# Altium schematic sheet supply.SchDoc
size A4; SheetNumber: 9; SheetTotal: 12; SPICEModelCacheMDRHNIGR: <root> / <DocumentId>MDRHNIGR</DocumentId> / </root>
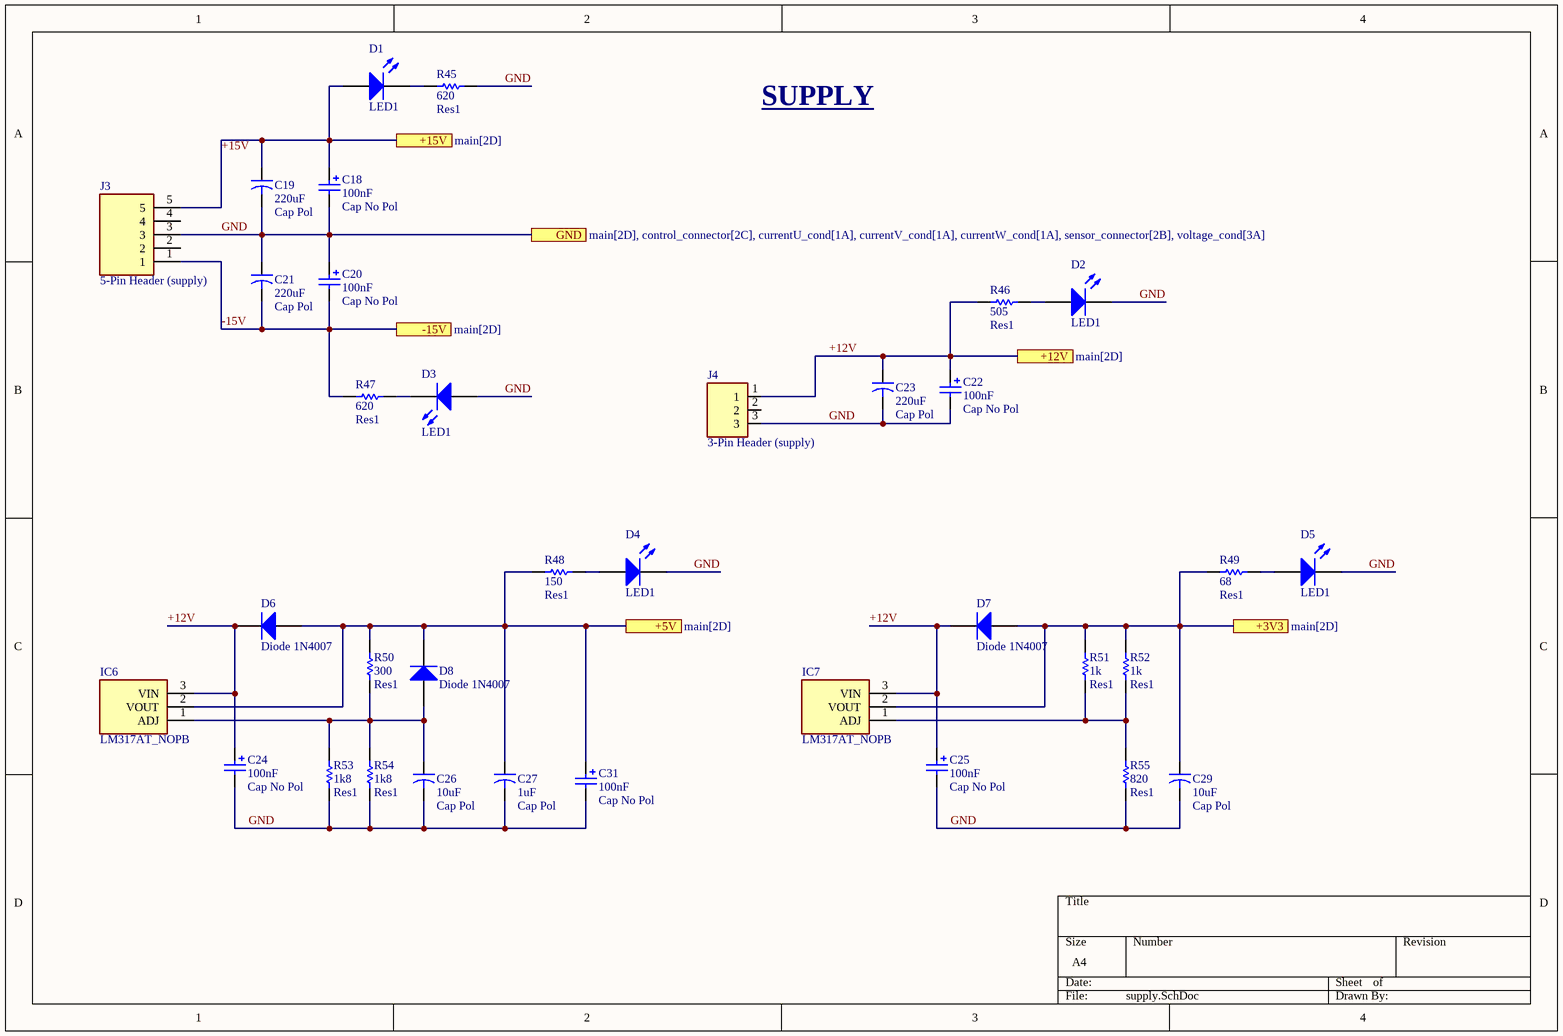
[diagram p0: supply.SchDoc]

## Parts
C18  Cap No Pol  value 100nF  [RAD-0.1_mod]
C19  Cap Pol  value 220uF  [CAPR5-4X5_mod]
C20  Cap No Pol  value 100nF  [RAD-0.1_mod]
C21  Cap Pol  value 220uF  [CAPR5-4X5_mod]
C22  Cap No Pol  value 100nF  [RAD-0.1_mod]
C23  Cap Pol  value 220uF  [CAPR5-4X5_mod]
C24  Cap No Pol  value 100nF  [RAD-0.1_mod]
C25  Cap No Pol  value 100nF  [RAD-0.1_mod]
C26  Cap Pol  value 10uF  [CAPR5-4X5_mod]
C27  Cap Pol  value 1uF  [CAPR5-4X5_mod]
C29  Cap Pol  value 10uF  [CAPR5-4X5_mod]
C31  Cap No Pol  value 100nF  [RAD-0.1_mod]
D1  LED1  [PIN2_mod]
D2  LED1  [PIN2_mod]
D3  LED1  [PIN2_mod]
D4  LED1  [PIN2_mod]
D5  LED1  [PIN2_mod]
D6  Diode 1N4007  [DO-41_mod]
D7  Diode 1N4007  [DO-41_mod]
D8  Diode 1N4007  [DO-41_mod]
IC6  LM317AT_NOPB  [TO254_mod]
IC7  LM317AT_NOPB  [TO254_mod]
J3  5-Pin Header (supply)  [MSTBA_5-PIN_HEADER_mod]
J4  3-Pin Header (supply)  [MSTBA_3-PIN_HEADER_mod]
R45  Res1  value 620  [AXIAL-0.3_mod]
R46  Res1  value 505  [AXIAL-0.3_mod]
R47  Res1  value 620  [AXIAL-0.3_mod]
R48  Res1  value 150  [AXIAL-0.3_mod]
R49  Res1  value 68  [AXIAL-0.3_mod]
R50  Res1  value 300  [AXIAL-0.3_mod]
R51  Res1  value 1k  [AXIAL-0.3_mod]
R52  Res1  value 1k  [AXIAL-0.3_mod]
R53  Res1  value 1k8  [AXIAL-0.3_mod]
R54  Res1  value 1k8  [AXIAL-0.3_mod]
R55  Res1  value 820  [AXIAL-0.3_mod]

## Ports
+3V3 (see main[2D]), +5V (see main[2D]), +12V (see main[2D]), +15V (see main[2D]), -15V (see main[2D]), GND (see main[2D], control_connector[2C], currentU_cond[1A], currentV_cond[1A], currentW_cond[1A], sensor_connector[2B], voltage_cond[3A])

## Nets
+3V3: C29.1 D7.1(A) IC7.2(VOUT) R49.1 R51.1 R52.1 ; port +3V3
+5V: C27.1 C31.1 D6.1(A) D8.2(K) IC6.2(VOUT) R48.1 R50.1 ; port +5V
+12V: C22.1 C23.1 C24.1 C25.1 D6.2(K) D7.2(K) IC6.3(VIN) IC7.3(VIN) J4.1 R46.1 ; port +12V
+15V: C18.1 C19.1 D1.1(A) J3.5 ; port +15V
-15V: C20.2 C21.2 J3.1 R47.2 ; port -15V
GND: C18.2 C19.2 C20.1 C21.1 C22.2 C23.2 C24.2 C25.2 C26.2 C27.2 C29.2 C31.2 D2.2(K) D3.1(A) D4.2(K) D5.2(K) J3.3 J4.3 R45.2 R53.2 R54.2 R55.2 ; port GND
NetC26_1: C26.1 D8.1(A) IC6.1(ADJ) R50.2 R53.1 R54.1
NetD1_2: D1.2(K) R45.1
NetD2_1: D2.1(A) R46.2
NetD3_2: D3.2(K) R47.1
NetD4_1: D4.1(A) R48.2
NetD5_1: D5.1(A) R49.2
NetIC7_1: IC7.1(ADJ) R51.2 R52.2 R55.1

Not connected (* = marked no-connect by the designer): J3 2 4; J4 2

## Notes on the sheet
- SUPPLY

## Library data of the parts
C18 C20 C22 C24 C25 C31 = Cap No Pol: Polarized Capacitor (Radial); Published: 8-Jun-2000; LatestRevisionDate: 17-Jul-2002; LatestRevisionNote: Re-released for DXP Platform.; PackageReference: RB7.6-15; Publisher: Altium Limited; PackageDescription: Polarized Capacitor (Radial); 2 Leads
C19 C21 C23 C26 C27 C29 = Cap Pol: Capacitor; Published: 23-Sep-2002; PackageReference: CAPR5-4X5; Publisher: Altium Limited; PackageDescription: Capacitor; 2 Leads
D1-D5 = LED1: Typical RED GaAs LED; Published: 8-Jun-2000; LatestRevisionDate: 08-Jul-2005; LatestRevisionNote: Mech Layer 1 removed.; PackageReference: LED-1; Publisher: Altium Limited; PackageDescription: LED; 2 Leads
D6-D8 = Diode 1N4007: 1 Amp General Purpose Rectifier; Published: 8-Jun-2000; LatestRevisionDate: 17-Jul-2002; LatestRevisionNote: Re-released for DXP Platform.; PackageVersion: Aug-1999; PackageReference: DO-41; Publisher: Altium Limited; PackageDescription: Diode, Axial; Body 5.2 x 2.7 mm (LxDia. max), Lead Dia. 0.86 mm (max); Code_JEDEC: DO-204-AL; DatasheetVersion: 1998; ComponentLink1Description: Manufacturer Link; ComponentLink1URL: http://www.fairchildsemi.com/; ComponentLink2Description: Datasheet; ComponentLink2URL: http://www.fairchildsemi.com/ds/1N%2F1N4001.pdf
IC6 IC7 = LM317AT_NOPB: Integrated Circuit; Manufacturer_Name: Texas Instruments; Manufacturer_Part_Number: LM317AT/NOPB; Datasheet Link: http://www.ti.com/lit/gpn/lm317a; Height: 4.7mm; Mouser Part Number: 926-LM317AT/NOPB; Mouser Price/Stock: https://www.mouser.co.uk/ProductDetail/Texas-Instruments/LM317AT-NOPB?qs=X1J7HmVL2ZFYFJRcNgsWcQ%3D%3D; Arrow Part Number: LM317AT/NOPB; Arrow Price/Stock: https://www.arrow.com/en/products/lm317atnopb/texas-instruments?region=nac
J3 = 1736175: Pluggable Terminal Blocks MSTBA 2,5/ 5-G- 5,08 VPE250; MF: Phoenix Contact; SnapEDA_Link: https://www.snapeda.com/parts/1736175/Phoenix+Contact/view-part/?ref=snap; Package: None; Value: *; MP: 1736175; Check_prices: https://www.snapeda.com/parts/1736175/Phoenix+Contact/view-part/?ref=eda
J4 = MSTBA_2,5/_3-G-5,08_1757255: 3 Position Terminal Block Header, Male Pins, Shrouded _4 Side_ 0.200 _5.08mm_ 90Â°, Right Angle Through Hole; MP: MSTBA 2,5/ 3-G-5,08 1757255; MF: Phoenix Contact; Value: *; Package: None; SnapEDA_Link: https://www.snapeda.com/parts/MSTBA%202%2C5/%203-G-5%2C08%201757255/Phoenix%20Contact/view-part/1675378/?ref=snap; Price: None; Availability: Unavailable
R45-R55 = Res1: Resistor; Published: 8-Jun-2000; LatestRevisionDate: 17-Jul-2002; LatestRevisionNote: Re-released for DXP Platform.; PackageReference: AXIAL-0.3; Publisher: Altium Limited; PackageDescription: Axial Device, Thru-Hole; 2 Leads; 0.3 in Pin Spacing